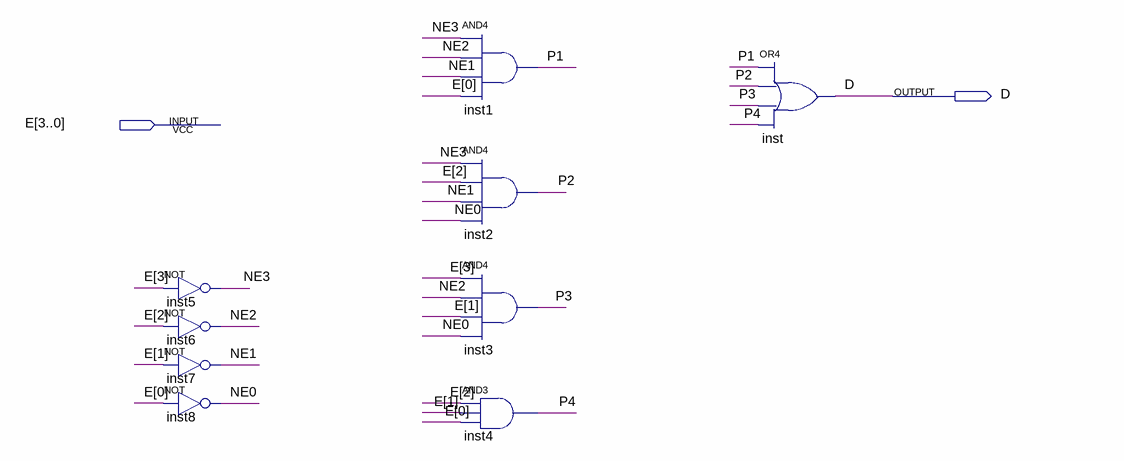
[diagram p0: schematic sheet]
// Quartus schematic D.bdf as structural Verilog: 9 symbols, 2 pins
module D (
  input  [3:0] E,
  output D
);

  wire NE0, NE1, NE2, NE3, P1, P2, P3, P4;

  not inst5 (NE3, E[3]);
  not inst6 (NE2, E[2]);
  not inst7 (NE1, E[1]);
  not inst8 (NE0, E[0]);
  and inst1 (P1, NE3, NE2, NE1, E[0]);
  and inst2 (P2, NE3, E[2], NE1, NE0);
  and inst3 (P3, E[3], NE2, E[1], NE0);
  and inst4 (P4, E[2], E[1], E[0]);
  or inst (D, P1, P2, P3, P4);
endmodule
